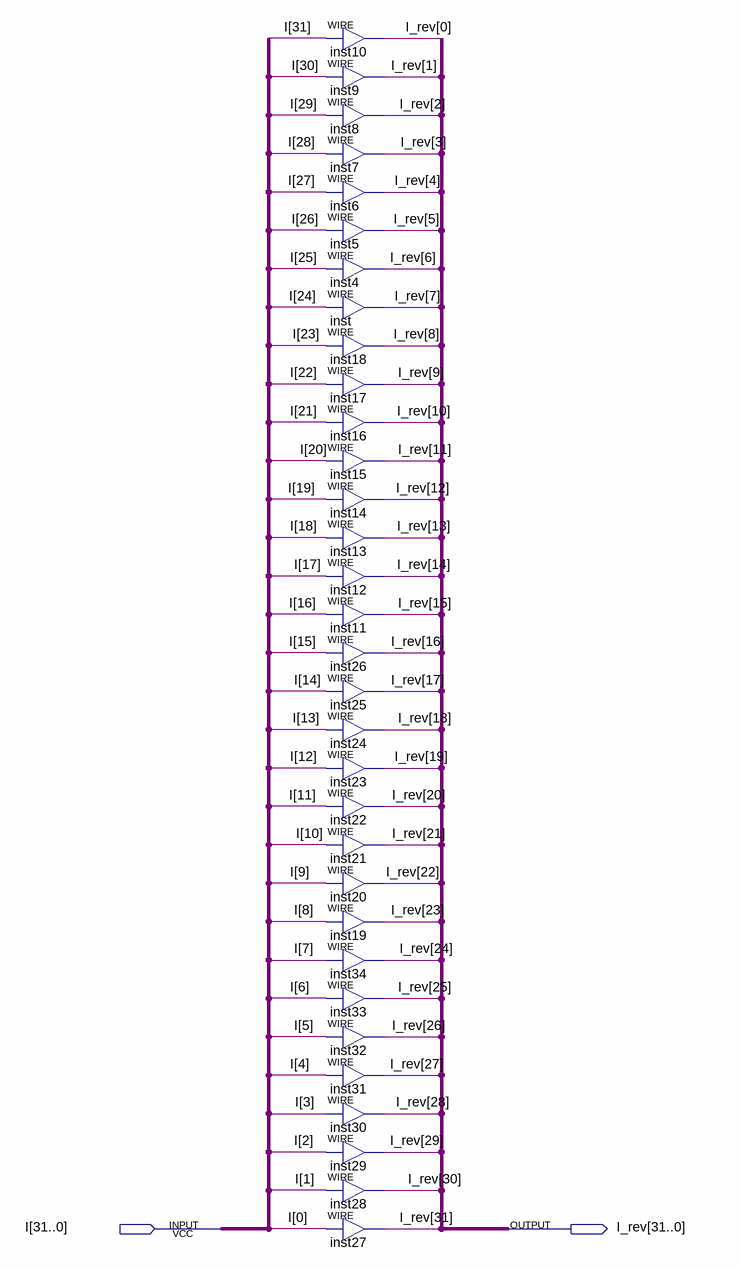
[diagram p0: schematic sheet]
// Quartus schematic bit_reverse32.bdf as structural Verilog: 32 symbols, 2 pins
module bit_reverse32 (
  input  [31:0] I,
  output [31:0] I_rev
);

  assign I_rev[0] = I[31];  // WIRE inst10
  assign I_rev[1] = I[30];  // WIRE inst9
  assign I_rev[2] = I[29];  // WIRE inst8
  assign I_rev[3] = I[28];  // WIRE inst7
  assign I_rev[4] = I[27];  // WIRE inst6
  assign I_rev[5] = I[26];  // WIRE inst5
  assign I_rev[6] = I[25];  // WIRE inst4
  assign I_rev[7] = I[24];  // WIRE inst
  assign I_rev[8] = I[23];  // WIRE inst18
  assign I_rev[9] = I[22];  // WIRE inst17
  assign I_rev[10] = I[21];  // WIRE inst16
  assign I_rev[11] = I[20];  // WIRE inst15
  assign I_rev[12] = I[19];  // WIRE inst14
  assign I_rev[13] = I[18];  // WIRE inst13
  assign I_rev[14] = I[17];  // WIRE inst12
  assign I_rev[15] = I[16];  // WIRE inst11
  assign I_rev[16] = I[15];  // WIRE inst26
  assign I_rev[17] = I[14];  // WIRE inst25
  assign I_rev[18] = I[13];  // WIRE inst24
  assign I_rev[19] = I[12];  // WIRE inst23
  assign I_rev[20] = I[11];  // WIRE inst22
  assign I_rev[21] = I[10];  // WIRE inst21
  assign I_rev[22] = I[9];  // WIRE inst20
  assign I_rev[23] = I[8];  // WIRE inst19
  assign I_rev[24] = I[7];  // WIRE inst34
  assign I_rev[25] = I[6];  // WIRE inst33
  assign I_rev[26] = I[5];  // WIRE inst32
  assign I_rev[27] = I[4];  // WIRE inst31
  assign I_rev[28] = I[3];  // WIRE inst30
  assign I_rev[29] = I[2];  // WIRE inst29
  assign I_rev[30] = I[1];  // WIRE inst28
  assign I_rev[31] = I[0];  // WIRE inst27
endmodule
